# Altium project bg_per.PrjPcb
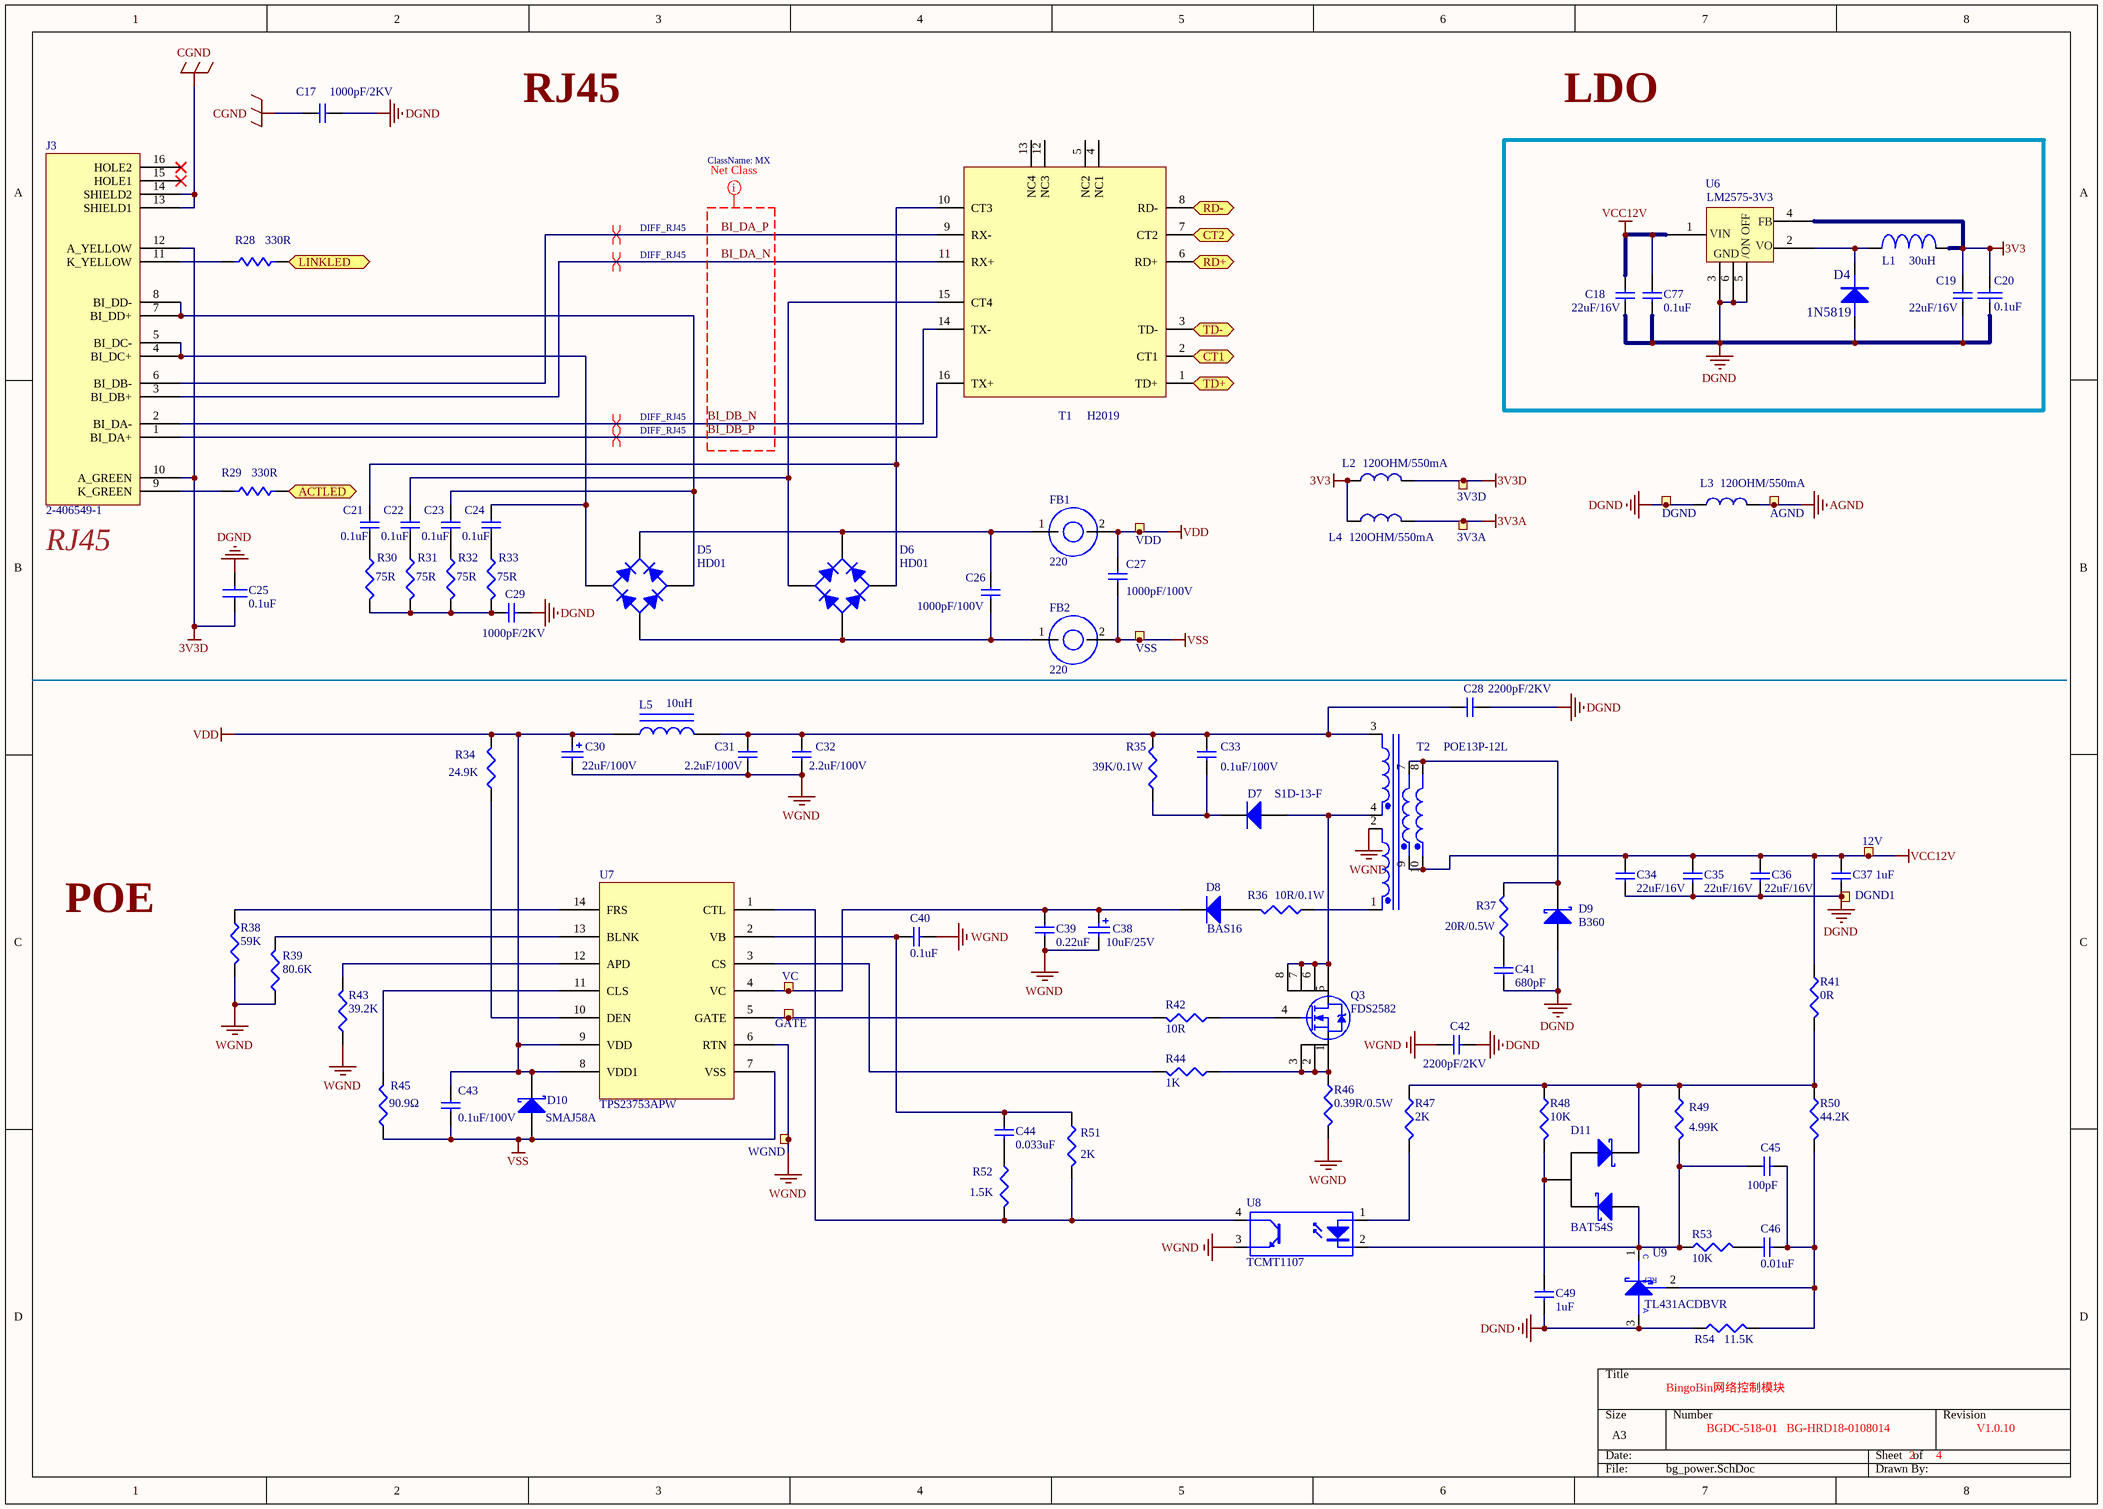
[diagram p0: bg_power.SchDoc]
4 sheets, 165 parts. Net scope: flat (ports and power ports of the same name join across sheets).
Board file: bg_PCB.PcbDoc
Sheets:
  bg_power.SchDoc
  bg_sensor.SchDoc
  bg_MCU.SchDoc
  view.SchDoc

## Sheet bg_power.SchDoc
size A3

### Parts
3V3A  ?.0mm,SMD  [TP_SMD_1_5mm]  (value not drawn)  (no BOM)
3V3D  ?.0mm,SMD  [TP_SMD_1_5mm]  (value not drawn)  (no BOM)
12V  ?.0mm,SMD  [TP_SMD_1_5mm]  (value not drawn)  (no BOM)
AGND  ?.0mm,SMD  [TP_SMD_1_5mm]  (value not drawn)  (no BOM)
C17  1000pF/2KV  [1808]
C18  22uF/16V  [C1210]
C19  22uF/16V  [C1210]
C20  0.1uF  [C0603]
C21  0.1uF  [C0603]
C22  0.1uF  [C0603]
C23  0.1uF  [C0603]
C24  0.1uF  [C0603]
C25  0.1uF  [C0603]
C26  1000pF/100V  [0805]
C27  1000pF/100V  [0805]
C28  2200pF/2KV  [1812]
C29  1000pF/2KV  [1808]
C30  22uF/100V  [C8*10.2mm]
C31  2.2uF/100V  [C1210]
C32  2.2uF/100V  [C1210]
C33  0.1uF/100V  [0805]
C34  22uF/16V  [C1210]
C35  22uF/16V  [C1210]
C36  22uF/16V  [C1210]
C37  1uF  [C0603]
C38  10uF/25V  [C4*5.8]
C39  0.22uF  [0805]
C40  0.1uF  [C0603]
C41  680pF  [0805]
C42  2200pF/2KV  [1812]
C43  0.1uF/100V  [0805]
C44  0.033uF  [C0603]
C45  100pF  [C0603]
C46  0.01uF  [C0603]
C49  1uF  [C0603]
C77  0.1uF  [C0603]
D4  1N5819  [SOD123]
D5  HD01  [HD01]
D6  HD01  [HD01]
D7  S1D-13-F  [SMA]
D8  BAS16  [SOT-23]
D9  B360  [SMC]
D10  SMAJ58A  [SMB]
D11  BAT54S  [SOT-23]
DGND  ?.0mm,SMD  [TP_SMD_1_5mm]  (value not drawn)  (no BOM)
DGND1  ?.0mm,SMD  [TP_SMD_1_5mm]  (value not drawn)  (no BOM)
FB1  220  [0805]
FB2  220  [0805]
GATE  ?.0mm,SMD  [TP_SMD_1mm]  (value not drawn)  (no BOM)
J3  2-406549-1  [RJ45LED]
L1  30uH  [L-7.5S]
L2  120OHM/550mA  [L0603]
L3  120OHM/550mA  [L0603]
L4  120OHM/550mA  [L0603]
L5  10uH  [L4*4mm]
Q3  FDS2582  [SO8]
R28  330R  [R0603]
R29  330R  [R0603]
R30  75R  [R0603]
R31  75R  [R0603]
R32  75R  [R0603]
R33  75R  [R0603]
R34  24.9K  [R0603]
R35  39K/0.1W  [0805]
R36  10R/0.1W  [0805]
R37  20R/0.5W  [2010]
R38  59K  [R0603]
R39  80.6K  [R0603]
R41  0R  [R0603]
R42  10R  [R0603]
R43  39.2K  [R0603]
R44  1K  [R0603]
R45  90.9Ω  [R0603]
R46  0.39R/0.5W  [1206]
R47  2K  [R0603]
R48  10K  [R0603]
R49  4.99K  [R0603]
R50  44.2K  [R0603]
R51  2K  [R0603]
R52  1.5K  [R0603]
R53  10K  [R0603]
R54  11.5K  [R0603]
T1  H2019  [H1102NL]
T2  POE13P-12L  [POE13P-12L]
U6  LM2575-3V3  [TO-263-5]
U7  TPS23753APW  [TPS23753a]
U8  TCMT1107  [SSOP4]
U9  TL431ACDBVR  [SOT-23]
VC  ?.0mm,SMD  [TP_SMD_1mm]  (value not drawn)  (no BOM)
VDD  ?.0mm,SMD  [TP_SMD_1_5mm]  (value not drawn)  (no BOM)
VSS  ?.0mm,SMD  [TP_SMD_1_5mm]  (value not drawn)  (no BOM)
WGND  ?.0mm,SMD  [TP_SMD_1mm]  (value not drawn)  (no BOM)

### Ports
ACTLED (bidir), CT1 (bidir), CT2 (bidir), LINKLED (bidir), RD+ (bidir), RD- (bidir), TD+ (bidir), TD- (bidir)

### Nets
3V3: C19.1 C20.1 L1.2 L2.1 L4.1 U6.4(FEEDBACK)
3V3A: 3V3A.1 L4.2
3V3D: 3V3D.1 C25.1 J3.10(A_GREEN) J3.12(A_YELLOW) L2.2
AGND: AGND.1 L3.2
CGND: C17.2 J3.13(SHIELD1) J3.14(SHIELD2)
DGND: C17.1 C18.2 C19.2 C20.2 C25.2 C28.2 C29.1 C34.1 C35.1 C36.1 C37.1 C41.1 C42.2 C49.1 C77.2 D4.1(A) D9.1(A) DGND.1 DGND1.1 L3.1 R54.1 U6.3(GND) U6.5(~{ON}/OFF) U6.6 U9.3(ANODE)
VCC12V: 12V.1 C18.1 C34.2 C35.2 C36.2 C37.2 C77.1 R41.1 T2.9(Pri+) T2.10(Pri+) U6.1(VIN)
VDD: C27.2 C30.1 C43.2 D10.2(K) FB1.2 L5.1 R34.2 U7.8(VDD1) U7.9(VDD) VDD.1
VSS: C27.1 C43.1 D10.1(A) FB2.2 R45.1 U7.7(VSS) VSS.1
WGND: C30.2 C31.1 C32.1 C38.2 C39.1 C40.1 C42.1 R38.2 R39.1 R43.1 R46.2 T2.2(Sec1-) U7.6(RTN) U8.3(E) WGND.1
BI_DA_N: J3.3(BI_DB+) T1.11(RX+)
BI_DA_P: J3.6(BI_DB-) T1.9(RX-)
BI_DB_N: J3.2(BI_DA-) T1.14(TX-)
BI_DB_P: J3.1(BI_DA+) T1.16(TX+)
RX_N: T1.8(RD-) ; port RD-
RX_P: T1.6(RD+) ; port RD+
TX_N: T1.3(TD-) ; port TD-
TX_P: T1.1(TD+) ; port TD+
NetC21_1: C21.1 R30.1
NetC21_2: C21.2 D6.2(C) T1.10(CT3)
NetC22_1: C22.1 R31.1
NetC22_2: C22.2 D6.4(C) T1.15(CT4)
NetC23_1: C23.1 R32.1
NetC23_2: C23.2 D5.2(C) J3.7(BI_DD+) J3.8(BI_DD-)
NetC24_1: C24.1 R33.1
NetC24_2: C24.2 D5.4(C) J3.4(BI_DC+) J3.5(BI_DC-)
NetC26_1: C26.1 D5.3(A) D6.3(A) FB2.1
NetC26_2: C26.2 D5.1(K) D6.1(K) FB1.1
NetC28_1: C28.1 C31.2 C32.2 C33.2 L5.2 R35.2 T2.3(Sec2-)
NetC29_2: C29.2 R30.2 R31.2 R32.2 R33.2
NetC33_1: C33.1 D7.2(K) R35.1
NetC38_1: C38.1 C39.2 D8.3(K) U7.4(VC) VC.1
NetC40_2: C40.2 C44.2 R51.1 U7.2(VB)
NetC41_2: C41.2 R37.1
NetC44_1: C44.1 R52.1
NetC45_1: C45.1 C46.1 R50.2 R54.2 U9.2(REF)
NetC45_2: C45.2 D11.1 R49.2 R53.1 U8.2(K) U9.1(cathode)
NetC46_2: C46.2 R53.2
NetC48_1: T1.2(CT1) ; port CT1
NetC49_2: C49.2 D11.3 R48.2
NetC56_1: T1.7(CT2) ; port CT2
NetD4_2: D4.2(K) L1.1 U6.2(OUTPU8T)
NetD7_1: D7.1(A) Q3.5(D) Q3.6 Q3.7 Q3.8 T2.4(Sec2+)
NetD8_1: D8.1(A) R36.2
NetD9_2: D9.2(K) R37.2 T2.7(Pri-) T2.8(Pri-)
NetD11_2: D11.2 R41.2 R47.1 R48.1 R49.1 R50.1
NetGATE_1: GATE.1 R42.2 U7.5(GATE)
NetJ3_9: J3.9(K_GREEN) R29.1
NetJ3_11: J3.11(K_YELLOW) R28.1
NetQ3_1: Q3.1(S) Q3.2 Q3.3 R44.1 R46.1
NetQ3_4: Q3.4(G) R42.1
NetR28_2: R28.2 ; port LINKLED
NetR29_2: R29.2 ; port ACTLED
NetR34_1: R34.1 U7.10(DEN)
NetR36_1: R36.1 T2.1(Sec1+)
NetR38_1: R38.1 U7.14(FRS)
NetR39_2: R39.2 U7.13(BLNK)
NetR43_2: R43.2 U7.12(APD)
NetR44_2: R44.2 U7.3(CS)
NetR45_2: R45.2 U7.11(CLS)
NetR47_2: R47.2 U8.1(A)
NetR51_2: R51.2 R52.2 U7.1(CTL) U8.4(C)

Not connected (* = marked no-connect by the designer): J3 15(HOLE1)* 16(HOLE2)*; T1 4(NC1) 5(NC2) 12(NC3) 13(NC4)

### Layout directives
differential pair; net class DIFF_RJ45: BI_DA_N, BI_DA_P, BI_DB_N, BI_DB_P
net class MX: BI_DA_N, BI_DA_P, BI_DB_N, BI_DB_P

### Notes on the sheet
- RJ45
- LDO
- (near J3) RJ45
- POE
- BingoBin网络控制模块
- BGDC-518-01   BG-HRD18-0108014
- 2
- 4
- V1.0.10
- (in symbol LM2575) FB; VO; /ON OFF
- (in symbol TL431AQDBZR) C; A

### Library data of the parts
3V3A 3V3D 12V AGND DGND DGND1 GATE VC VDD VSS WGND = TESTPAD: 1.0mm circular SMD testpad; Part Number: TP_SMD_?.0MM; Manufacturer: Nordic Semiconductor; Artikkelnr Noca: N.A.; Manufacturer Part Number: *; Datasheet: *; LatestRevisionDate: 2013-06-11; Pin Count: 1; Publisher: Nordic Semiconductor; Published: 2013-06-11; Value: ?.0mm,SMD; Note: *; Supplier: *; Supplier part number: *; 2nd source Supplier: *; 2nd source part number: *; Footprint Doc: TP_SMD_?.0mm; Artikkelnr Simpro: N.A.
C17 C29 = CAP_0603: Capacitor, Ceramic Chip,1000pF, 2KV, 10%,1808; Part Number: C0603-4µ7; Note: 6.3V; Artikkelnr Noca: 20069060; Artikkelnr Simpro: N.A.; Manufacturer: *; Manufacturer Part Number: *; Datasheet: *; LatestRevisionDate: 2009-11-23; Pin Count: 2; Publisher: Nordic Semiconductor; Published: 2009-05-08; Value: 1000pF/2KV; Supplier: *; Supplier part number: *; 2nd source Supplier: *; 2nd source part number: *; Footprint Doc: 0603
C18 C19 C34-C36 = CAP_0603: Capacitor, Ceramic, 22uF,16V, 10%,1210,X5R; Part Number: C0603-4µ7; Note: 6.3V; Artikkelnr Noca: 20069060; Artikkelnr Simpro: N.A.; Manufacturer: *; Manufacturer Part Number: *; Datasheet: *; LatestRevisionDate: 2009-11-23; Pin Count: 2; Publisher: Nordic Semiconductor; Published: 2009-05-08; Value: 22uF/16V; Supplier: *; Supplier part number: *; 2nd source Supplier: *; 2nd source part number: *; Footprint Doc: 0603
C20 = CAP: Capacitor, Ceramic, 0.1uF, 16V, 10%, 0603, X7R
C21-C24 = CAP_0603: Capacitor, Ceramic, 0.1uF, 100V, 10%, 0603, X7R; Part Number: C0603-4µ7; Note: 6.3V; Artikkelnr Noca: 20069060; Artikkelnr Simpro: N.A.; Manufacturer: *; Manufacturer Part Number: *; Datasheet: *; LatestRevisionDate: 2009-11-23; Pin Count: 2; Publisher: Nordic Semiconductor; Published: 2009-05-08; Value: 0.1uF; Supplier: *; Supplier part number: *; 2nd source Supplier: *; 2nd source part number: *; Footprint Doc: 0603
C25 = C1005X5R1H104K: Capacitor, Ceramic, 0.1uF, 16V, 10%, 0603, X7R; Manufacturer: TDK Corporation; Capacitance: 0.1礔; .Checked PCB: used; Voltage - Rated: 50V; Tolerance: ?0%; Temperature Coefficient: X5R; Category: Capacitors; Supplier Part Number: 445-5942-1-ND; Manufacturer Part Number: C1005X5R1H104K; Operating Temperature: -55癈 ~ 85癈; Package / Case: 0402 (1005 Metric); Price 1k [$]: 0.02340; Value: 0.1uF; .Checked SCH: used; Supplier: Digikey; Supplier 1: Digi-Key; Supplier Part Number 1: 445-5942-1-ND; RoHS: RoHS Compliant; Stock 1: 106926; Pricing 1: 1=0.27, 10=0.18, 100=0.072, 250=0.05176, 500=0.0369, 1000=0.027 (USD); Mounting Type: Surface Mount, MLCC; Applications: General Purpose; Ratings: -; Size / Dimension: 0.039" L x 0.020" W (1.00mm x 0.50mm); Height - Seated (Max): -; Thickness (Max): 0.022" (0.55mm); Lead Spacing: -; Features: -; Packaging: Cut Tape (CT); Lead Style: -; ComponentLink1URL: http://www.tdk.co.jp/tefe02/e412_c.pdf; ComponentLink1Description: http://www.tdk.co.jp/tefe02/e412_c.pdf
C26 C27 = CAP_0603: Capacitor, Ceramic, 1000pF,100V, 10%,0805,X7R; Part Number: C0603-4µ7; Note: 6.3V; Artikkelnr Noca: 20069060; Artikkelnr Simpro: N.A.; Manufacturer: *; Manufacturer Part Number: *; Datasheet: *; LatestRevisionDate: 2009-11-23; Pin Count: 2; Publisher: Nordic Semiconductor; Published: 2009-05-08; Value: 1000pF/100V; Supplier: *; Supplier part number: *; 2nd source Supplier: *; 2nd source part number: *; Footprint Doc: 0603
C28 C42 = CAP_0603: Capacitor, Ceramic, 2200pF,2KV, 20%,1812,X7R; Part Number: C0603-4µ7; Note: 6.3V; Artikkelnr Noca: 20069060; Artikkelnr Simpro: N.A.; Manufacturer: *; Manufacturer Part Number: *; Datasheet: *; LatestRevisionDate: 2009-11-23; Pin Count: 2; Publisher: Nordic Semiconductor; Published: 2009-05-08; Value: 2200pF/2KV; Supplier: *; Supplier part number: *; 2nd source Supplier: *; 2nd source part number: *; Footprint Doc: 0603
C30 = Cap Pol2: Capacitor, Aluminum Electrolytic, 22uF,100V, 20%; Published: 8-Jun-2000; LatestRevisionDate: 17-Jul-2002; LatestRevisionNote: Re-released for DXP Platform.; PackageReference: POLAR0.8; Publisher: Altium Limited; PackageDescription: Polarized Capacitor; 2 Leads; Value: 22uF/100V
C31 C32 = CAP_0603: Capacitor, Ceramic, 2.2uF,100V, 10%,1210,X7R; Part Number: C0603-4µ7; Note: 6.3V; Artikkelnr Noca: 20069060; Artikkelnr Simpro: N.A.; Manufacturer: *; Manufacturer Part Number: *; Datasheet: *; LatestRevisionDate: 2009-11-23; Pin Count: 2; Publisher: Nordic Semiconductor; Published: 2009-05-08; Value: 2.2uF/100V; Supplier: *; Supplier part number: *; 2nd source Supplier: *; 2nd source part number: *; Footprint Doc: 0603
C33 C43 = CAP_0603: Capacitor, Ceramic, 0.1uF,100V, 10%,0805,X7R; Part Number: C0603-4µ7; Note: 6.3V; Artikkelnr Noca: 20069060; Artikkelnr Simpro: N.A.; Manufacturer: *; Manufacturer Part Number: *; Datasheet: *; LatestRevisionDate: 2009-11-23; Pin Count: 2; Publisher: Nordic Semiconductor; Published: 2009-05-08; Value: 0.1uF/100V; Supplier: *; Supplier part number: *; 2nd source Supplier: *; 2nd source part number: *; Footprint Doc: 0603
C37 C49 = CAP_0603: Capacitor, Ceramic, 1uF, 25V, 10%, 0603, X7R; Part Number: C0603-4µ7; Note: 6.3V; Artikkelnr Noca: 20069060; Artikkelnr Simpro: N.A.; Manufacturer: *; Manufacturer Part Number: *; Datasheet: *; LatestRevisionDate: 2009-11-23; Pin Count: 2; Publisher: Nordic Semiconductor; Published: 2009-05-08; Value: 1uF; Supplier: *; Supplier part number: *; 2nd source Supplier: *; 2nd source part number: *; Footprint Doc: 0603
C38 = Cap Pol2: Capacitor, Aluminum,10uF, 25V, 20%; Published: 8-Jun-2000; LatestRevisionDate: 17-Jul-2002; LatestRevisionNote: Re-released for DXP Platform.; PackageReference: POLAR0.8; Publisher: Altium Limited; PackageDescription: Polarized Capacitor; 2 Leads; Value: 10uF/25V
C39 = CAP_0603: Capacitor, Ceramic, 0.22uF,25V, 10%,0805,X7R; Part Number: C0603-4µ7; Note: 6.3V; Artikkelnr Noca: 20069060; Artikkelnr Simpro: N.A.; Manufacturer: *; Manufacturer Part Number: *; Datasheet: *; LatestRevisionDate: 2009-11-23; Pin Count: 2; Publisher: Nordic Semiconductor; Published: 2009-05-08; Value: 0.22uF; Supplier: *; Supplier part number: *; 2nd source Supplier: *; 2nd source part number: *; Footprint Doc: 0603
C40 = CAP_0603: Capacitor, Ceramic, 0.1uF, 16V, 10%, 0603, X7R; Part Number: C0603-4µ7; Note: 6.3V; Artikkelnr Noca: 20069060; Artikkelnr Simpro: N.A.; Manufacturer: *; Manufacturer Part Number: *; Datasheet: *; LatestRevisionDate: 2009-11-23; Pin Count: 2; Publisher: Nordic Semiconductor; Published: 2009-05-08; Value: 0.1uF; Supplier: *; Supplier part number: *; 2nd source Supplier: *; 2nd source part number: *; Footprint Doc: 0603
C41 = CAP_0603: Capacitor, Ceramic, 680pF,50V,5%,0805, NPO; Part Number: C0603-4µ7; Note: 6.3V; Artikkelnr Noca: 20069060; Artikkelnr Simpro: N.A.; Manufacturer: *; Manufacturer Part Number: *; Datasheet: *; LatestRevisionDate: 2009-11-23; Pin Count: 2; Publisher: Nordic Semiconductor; Published: 2009-05-08; Value: 680pF; Supplier: *; Supplier part number: *; 2nd source Supplier: *; 2nd source part number: *; Footprint Doc: 0603
C44 = CAP_0603: Capacitor, Ceramic, 0.033uF, 50V, 10%, 0603, X7R; Part Number: C0603-4µ7; Note: 6.3V; Artikkelnr Noca: 20069060; Artikkelnr Simpro: N.A.; Manufacturer: *; Manufacturer Part Number: *; Datasheet: *; LatestRevisionDate: 2009-11-23; Pin Count: 2; Publisher: Nordic Semiconductor; Published: 2009-05-08; Value: 0.033uF; Supplier: *; Supplier part number: *; 2nd source Supplier: *; 2nd source part number: *; Footprint Doc: 0603
C45 = CAP_0603: Capacitor, Ceramic, 100pF, 50V, 5%, 0603, X7R; Part Number: C0603-4µ7; Note: 6.3V; Artikkelnr Noca: 20069060; Artikkelnr Simpro: N.A.; Manufacturer: *; Manufacturer Part Number: *; Datasheet: *; LatestRevisionDate: 2009-11-23; Pin Count: 2; Publisher: Nordic Semiconductor; Published: 2009-05-08; Value: 100pF; Supplier: *; Supplier part number: *; 2nd source Supplier: *; 2nd source part number: *; Footprint Doc: 0603
C46 = CAP_0603: Capacitor, Ceramic, 0.01uF, 50V, 10%, 0603, X7R; Part Number: C0603-4µ7; Note: 6.3V; Artikkelnr Noca: 20069060; Artikkelnr Simpro: N.A.; Manufacturer: *; Manufacturer Part Number: *; Datasheet: *; LatestRevisionDate: 2009-11-23; Pin Count: 2; Publisher: Nordic Semiconductor; Published: 2009-05-08; Value: 0.01uF; Supplier: *; Supplier part number: *; 2nd source Supplier: *; 2nd source part number: *; Footprint Doc: 0603
C77 = CAP_0603: Capacitor, X5R, ±10%; Part Number: C0603-4µ7; Note: 6.3V; Artikkelnr Noca: 20069060; Artikkelnr Simpro: N.A.; Manufacturer: *; Manufacturer Part Number: *; Datasheet: *; LatestRevisionDate: 2009-11-23; Pin Count: 2; Publisher: Nordic Semiconductor; Published: 2009-05-08; Value: 0.1uF; Supplier: *; Supplier part number: *; 2nd source Supplier: *; 2nd source part number: *; Footprint Doc: 0603
D4 = DIODE: Diode Schottky, 40V,1A
D5 D6 = Bridge1: Bridge Rectifier, 100V, 0.8A, Glass Passivated, SMD; Published: 8-Jun-2000; LatestRevisionDate: 29-May-2009; LatestRevisionNote: Sch pins A & K swapped.; DatasheetVersion: E2732B; PackageReference: D-38; Publisher: Altium Limited; PackageDescription: Bridge Rectifier; 4 Terminals; Body 9.4 x 9.4 mm (typ); Pitch 5.08 mm
D7 = Diode: Diode, Rectifier, 1A, 200V; Published: 8-Jun-2000; LatestRevisionDate: 17-Jul-2002; LatestRevisionNote: Re-released for DXP Platform.; PackageVersion: Sep-1996; PackageReference: SMC; Publisher: Altium Limited; PackageDescription: DO-214-AB/SMC; 2 C-Bend Leads; Body 7.9 x 5.9 mm, inc. leads (LxW); Code_JEDEC: DO-214-AB
D8 = BAS16: Diode, Switching, 200mA, 75V, 225mW; Published: 8-Jun-2000; LatestRevisionDate: 17-Jul-2002; LatestRevisionNote: Re-released for DXP Platform.; PackageVersion: Sep-1996; PackageReference: SMC; Publisher: Altium Limited; PackageDescription: DO-214-AB/SMC; 2 C-Bend Leads; Body 7.9 x 5.9 mm, inc. leads (LxW); Code_JEDEC: DO-214-AB
D9 = D Schottky: Diode Schottky, 60V, 3A, SMC; Published: 8-Jun-2000; LatestRevisionDate: 17-Jul-2002; LatestRevisionNote: Re-released for DXP Platform.; PackageReference: SMB; Publisher: Altium Limited; PackageDescription: DO-214-AA/SMB; 2 C-Bend Leads; Body 5.3 x 3.6 mm, inc. leads (LxW); Code_JEDEC: DO-214-AA
D10 = D Schottky: Diode,Transient Voltage Suppressor,400W,58V; Published: 8-Jun-2000; LatestRevisionDate: 17-Jul-2002; LatestRevisionNote: Re-released for DXP Platform.; PackageReference: SMB; Publisher: Altium Limited; PackageDescription: DO-214-AA/SMB; 2 C-Bend Leads; Body 5.3 x 3.6 mm, inc. leads (LxW); Code_JEDEC: DO-214-AA
D11 = D Schottky: Diode, Dual Schottky, 200mA, 30V; Published: 8-Jun-2000; LatestRevisionDate: 17-Jul-2002; LatestRevisionNote: Re-released for DXP Platform.; PackageReference: SMB; Publisher: Altium Limited; PackageDescription: DO-214-AA/SMB; 2 C-Bend Leads; Body 5.3 x 3.6 mm, inc. leads (LxW); Code_JEDEC: DO-214-AA
FB1 FB2 = FB: Bead, Ferrite, SMT, 220 Ohms, 3A
J3 = 2-406549-1: RJ45连接器/RJ45网口连接器,8p8c,90°,黄-绿LED灯,镀金,带屏蔽; Manufacturer: Tyco; .Checked PCB: used; Connector Type: Jack; Number of Positions: 8p8c (RJ45, Ethernet); Number of Ports: 1; Shielding: Shielded, EMI Finger; Ratings: Cat5; LED Color: Yellow - Green; Tab Direction: Up; .Checked SCH: used; Category: Connectors, Interconnects; Manufacturer Part Number: 2-406549-1; Price 1k [$]: 1.73278; Supplier: Digikey; Supplier Part Number: A97715-ND; Value: 2-406549-1; Supplier 1: Digi-Key; Supplier Part Number 1: A97715-ND; RoHS: RoHS Compliant; Stock 1: 9021; Pricing 1: 1=3.42 (USD); Number of Positions/Contacts: 8p8c (RJ45, Ethernet); Number of Rows: 1; Mounting Type: Through Hole; Orientation: 90?Angle (Right); Termination: Solder; Features: Board Lock; Packaging: Tray; Housing Material: Thermoplastic; Contact Material: Phosphor Bronze; Contact Finish: Gold; Operating Temperature: -40癈 ~ 85癈; ComponentLink1URL: http://documents.tycoelectronics.com/commerce/DocumentDelivery/DDEController?Action=srchrtrv&DocNm=406549&DocType=CD&DocLang=EN; ComponentLink1Description: http://documents.tycoelectronics.com/commerce/DocumentDelivery/DDEController?Action=srchrtrv&DocNm=406549&DocType=CD&DocLang=EN
L1 = BEAD: 330uH功率电感; Text Field1: Tie pins 14 and 15 to positive supply or leave floating. Do not tie to VSSA
L2-L4 = L0603: Bead, Ferrite, SMT, 120 Ohms, 3A; Type: 120OHM/550mA
L5 = Inductor Iron: Inductor, SMT, 750mA, 350 milliohm,10uH; Published: 24-Mar-1999; LatestRevisionDate: 17-Jul-2002; LatestRevisionNote: Re-released for DXP Platform.; PackageReference: AXIAL-0.9; Publisher: Altium Limited; PackageDescription: Axial Device, Thru-Hole; 2 Leads; 0.9 in Pin Spacing; Value: 10uH
Q3 = NMOS-2: MOSFET, N-ch, 150-V, 4.1A, 66 milliOhms; Note: Pin 2 is electrically connected to pin 4.; Published: 8-Jun-2000; LatestRevisionDate: 17-Jul-2002; LatestRevisionNote: Re-released for DXP Platform.; DatasheetVersion: PD-9.814; PackageVersion: Feb-1997; PackageReference: TO-220AB; Publisher: Altium Limited; PackageDescription: TO, Thru-Hole, Vertical, Heatsink Mounted; 3 In-Line Leads; Pitch 2.54 mm; ComponentLink1Description: Manufacturer Link; ComponentLink1URL: http://www.irf.com/
R28 R29 = R0603: RES, THICK FILM, 330 OHM, 5%, 1/10W, 0603; Value: 330R
R30-R33 = Res3: RES, THICK FILM, 75 OHM, 1%, 1/10W, 0603; Published: 8-Jun-2000; LatestRevisionDate: 29-May-2009; LatestRevisionNote: IPC-7351 Footprint Added.; PackageReference: J1-0603; Publisher: Altium Limited; PackageDescription: Chip Resistor; Value: 75R
R34 = Res3: RES, THICK FILM, 24.9K, 1%, 1/10W, 0603; Published: 8-Jun-2000; LatestRevisionDate: 29-May-2009; LatestRevisionNote: IPC-7351 Footprint Added.; PackageReference: J1-0603; Publisher: Altium Limited; PackageDescription: Chip Resistor; Value: 24.9K
R35 = Res3: RES, THICK FILM, 39K, 1%, 1/8W, 0805; Published: 8-Jun-2000; LatestRevisionDate: 29-May-2009; LatestRevisionNote: IPC-7351 Footprint Added.; PackageReference: J1-0603; Publisher: Altium Limited; PackageDescription: Chip Resistor; Value: 39K/0.1W
R36 = Res3: RES, THICK FILM, 10 OHM, 1%, 1/8W, 0805; Published: 8-Jun-2000; LatestRevisionDate: 29-May-2009; LatestRevisionNote: IPC-7351 Footprint Added.; PackageReference: J1-0603; Publisher: Altium Limited; PackageDescription: Chip Resistor; Value: 10R/0.1W
R37 = Res3: RES, THICK FILM, 20 OHM, 5%, 1/2W, 2010; Published: 8-Jun-2000; LatestRevisionDate: 29-May-2009; LatestRevisionNote: IPC-7351 Footprint Added.; PackageReference: J1-0603; Publisher: Altium Limited; PackageDescription: Chip Resistor; Value: 20R/0.5W
R38 = Res3: RES, THICK FILM, 59K, 1%, 1/10W, 0603; Published: 8-Jun-2000; LatestRevisionDate: 29-May-2009; LatestRevisionNote: IPC-7351 Footprint Added.; PackageReference: J1-0603; Publisher: Altium Limited; PackageDescription: Chip Resistor; Value: 59K
R39 = Res3: RES, THICK FILM, 80.6K, 1%, 1/10W, 0603; Published: 8-Jun-2000; LatestRevisionDate: 29-May-2009; LatestRevisionNote: IPC-7351 Footprint Added.; PackageReference: J1-0603; Publisher: Altium Limited; PackageDescription: Chip Resistor; Value: 80.6K
R41 = Res3: RES, THICK FILM, 0 OHM, 1%, 1/10W, 0603; Published: 8-Jun-2000; LatestRevisionDate: 29-May-2009; LatestRevisionNote: IPC-7351 Footprint Added.; PackageReference: J1-0603; Publisher: Altium Limited; PackageDescription: Chip Resistor; Value: 0R
R42 = Res3: RES, THICK FILM, 10 OHM, 5%, 1/10W, 0603; Published: 8-Jun-2000; LatestRevisionDate: 29-May-2009; LatestRevisionNote: IPC-7351 Footprint Added.; PackageReference: J1-0603; Publisher: Altium Limited; PackageDescription: Chip Resistor; Value: 10R
R43 = Res3: RES, THICK FILM, 39.2K, 1%, 1/10W, 0603; Published: 8-Jun-2000; LatestRevisionDate: 29-May-2009; LatestRevisionNote: IPC-7351 Footprint Added.; PackageReference: J1-0603; Publisher: Altium Limited; PackageDescription: Chip Resistor; Value: 39.2K
R44 = Res3: RES, THICK FILM, 1K, 5%, 1/10W, 0603; Published: 8-Jun-2000; LatestRevisionDate: 29-May-2009; LatestRevisionNote: IPC-7351 Footprint Added.; PackageReference: J1-0603; Publisher: Altium Limited; PackageDescription: Chip Resistor; Value: 1K
R45 = Res3: RES, THICK FILM, 90.9 OHM, 1%, 1/10W, 0603; Published: 8-Jun-2000; LatestRevisionDate: 29-May-2009; LatestRevisionNote: IPC-7351 Footprint Added.; PackageReference: J1-0603; Publisher: Altium Limited; PackageDescription: Chip Resistor; Value: 90.9Ω
R46 = Res3: RES, THICK FILM, 0.39 OHM, 1%, 3/4W, 2010; Published: 8-Jun-2000; LatestRevisionDate: 29-May-2009; LatestRevisionNote: IPC-7351 Footprint Added.; PackageReference: J1-0603; Publisher: Altium Limited; PackageDescription: Chip Resistor; Value: 0.39R/0.5W
R47 R51 = Res3: RES, THICK FILM, 2K, 5%, 1/10W, 0603; Published: 8-Jun-2000; LatestRevisionDate: 29-May-2009; LatestRevisionNote: IPC-7351 Footprint Added.; PackageReference: J1-0603; Publisher: Altium Limited; PackageDescription: Chip Resistor; Value: 2K
R48 R53 = Res3: RES, THICK FILM, 10K, 5%, 1/10W, 0603; Published: 8-Jun-2000; LatestRevisionDate: 29-May-2009; LatestRevisionNote: IPC-7351 Footprint Added.; PackageReference: J1-0603; Publisher: Altium Limited; PackageDescription: Chip Resistor; Value: 10K
R49 = Res3: RES, THICK FILM, 4.99K, 1%, 1/10W, 0603; Published: 8-Jun-2000; LatestRevisionDate: 29-May-2009; LatestRevisionNote: IPC-7351 Footprint Added.; PackageReference: J1-0603; Publisher: Altium Limited; PackageDescription: Chip Resistor; Value: 4.99K
R50 = Res3: RES, THICK FILM, 44.2K, 1%, 1/10W, 0603; Published: 8-Jun-2000; LatestRevisionDate: 29-May-2009; LatestRevisionNote: IPC-7351 Footprint Added.; PackageReference: J1-0603; Publisher: Altium Limited; PackageDescription: Chip Resistor; Value: 44.2K
R52 = Res3: RES, THICK FILM, 1.5K, 5%, 1/10W, 0603; Published: 8-Jun-2000; LatestRevisionDate: 29-May-2009; LatestRevisionNote: IPC-7351 Footprint Added.; PackageReference: J1-0603; Publisher: Altium Limited; PackageDescription: Chip Resistor; Value: 1.5K
R54 = Res3: RES, THICK FILM, 11.5K, 1%, 1/10W, 0603; Published: 8-Jun-2000; LatestRevisionDate: 29-May-2009; LatestRevisionNote: IPC-7351 Footprint Added.; PackageReference: J1-0603; Publisher: Altium Limited; PackageDescription: Chip Resistor; Value: 11.5K
T1 = H1102NL: XFMR, 1000 Base-T, Ratio 1:1
T2 = Trans3: Transformer, Flyback For PoE, 12V, 1A; Sim Note: Enter the turns ratios, Core loss resistance, Magnetising Reactance, Leakage Reactances and Resistances referred to the primary side into the parameter fields.; Published: 25-Jan-2001; LatestRevisionDate: 17-Jul-2002; LatestRevisionNote: Re-released for DXP Platform.; PackageReference: TRF_6; Publisher: Altium Limited; PackageDescription: Transformer; 6 Leads
U6 = LM2575: SIMPLE SWITCHER® 1A Step-Down Voltage Regulator
U7 = TPS23753APW: IC, IEEE 802.3af Integrated Primary Side Controller
U8 = Optoisolator1: IC, Photocoupler, 3750VRMS, 80-160% CTR; Published: 24-Mar-1999; LatestRevisionDate: 04-Mar-2005; LatestRevisionNote: Sch pins 3 & 4 Swapped.; DatasheetVersion: Nov-2003; PackageReference: DIP-4; Publisher: Altium Limited
U9 = TL431AQDBZR: IC, Shunt Regulator, 2.5V Ref, 36V, 100mA, 1%; Manufacturer: Texas Instruments; Output Type: Adjustable; Voltage - Output (Min/Fixed): 2.495V; Current - Cathode: 700µA; .Checked PCB: MM; Supplier 1: Digi-Key; Manufacturer Part Number: TL431AQDBZR; RoHS: RoHS Compliant; Category: Integrated Circuits (ICs); Stock 1: 14090; Pricing 1: 1=0.48, 10=0.323, 100=0.151, 1000=0.131 (USD); Packaging: Cut Tape (CT); Reference Type: Shunt; Voltage - Output (Max): 36V; Current - Output: 100mA; Tolerance: ±1%; Temperature Coefficient: -; Noise - 0.1Hz to 10Hz: -; Noise - 10Hz to 10kHz: -; Voltage - Input: -; Current - Supply: -; Operating Temperature: -40°C ~ 125°C (TA); Mounting Type: Surface Mount; Package / Case: TO-236-3, SC-59, SOT-23-3; Supplier Device Package: SOT-23-3; ComponentLink1URL: http://www.ti.com/lit/ds/symlink/tl431a.pdf; ComponentLink1Description: http://www.ti.com/lit/ds/symlink/tl431a.pdf; Supplier Part Number 1: 296-18864-1-ND; .Checked SCH: MM; .Creator: MM

## Sheet bg_sensor.SchDoc
size A3
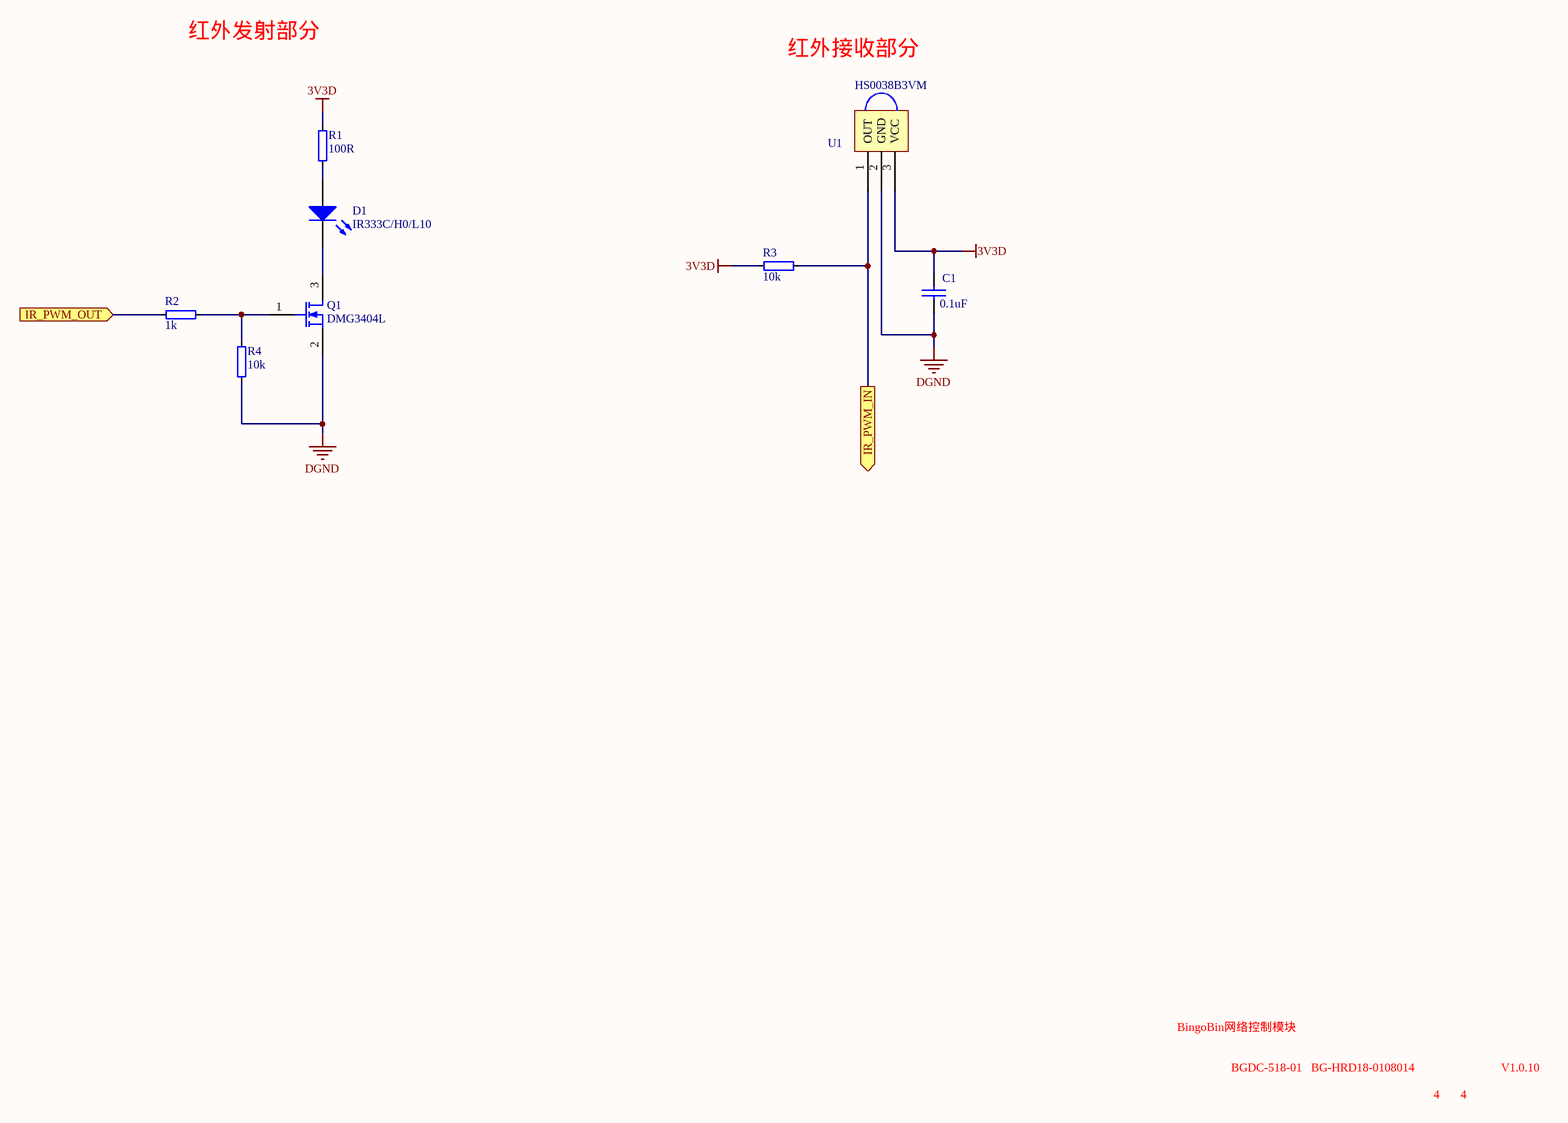
[diagram p1: bg_sensor.SchDoc]

### Parts
C1  0.1uF  [C0603]
D1  IR333C/H0/L10  [LED]
Q1  DMG3404L  [sot-23]
R1  100R  [R0603]
R2  1k  [R0603]
R3  10k  [R0603]
R4  10k  [R0603]
U1  HS0038B3VM  [DIP_3]

### Ports
IR_PWM_IN (out), IR_PWM_OUT (in)

### Nets
3V3D: C1.2 R1.2 R3.2 U1.3(VCC)
DGND: C1.1 Q1.2(S) R4.1 U1.2(GND)
NetD1_1: D1.1(A) R1.1
NetD1_2: D1.2(K) Q1.3(D)
NetQ1_1: Q1.1(G) R2.2 R4.2
NetR2_1: R2.1 ; port IR_PWM_OUT
NetR3_1: R3.1 U1.1(OUT) ; port IR_PWM_IN

### Notes on the sheet
- 红外发射部分
- 红外接收部分
- BingoBin网络控制模块
- BGDC-518-01   BG-HRD18-0108014
- 4
- V1.0.10

### Library data of the parts
C1 = C0603: Capacitor, Ceramic, 0.1uF, 16V, 10%, 0603, X7R; Manufacturer: muRata; Value: 0.1uF; Manufacturer Part Number: *
D1 = LED1: Typical RED GaAs LED; Manufacturer: EVERLIGHT; Value: IR333C/H0/L10; data_net: http://www.szlcsc.com/product/pdf/A_CE940DB3AD015B83.PDF; Manufacturer Part Number: IR333C/H0/L10
Q1 = MOSFET-N: N沟道,30V,5.6A,27mΩ(Typ,@Vgs=4.5V); Manufacturer: DIODES; Published: 8-Jun-2000; LatestRevisionDate: 17-Jul-2002; LatestRevisionNote: Re-released for DXP Platform.; PackageVersion: 1995/1996; PackageReference: E3; Publisher: Altium Limited; PackageDescription: TO, Flat Index; 3 In-Line, Axial Leads; Body Dia. 4.6mm; Lead Dia. 0.5 mm (max); Manufacturer Part Number: DMG3404L; Value: DMG3404L
R1-R4 = R0402-12k: RES, THICK FILM, 10K, 5%, 1/10W, 0603; Part Number: R0402-10k; Manufacturer: muRata; Note: Chip Res 1%; Artikkelnr Noca: 27049099; Manufacturer Part Number: *; Datasheet: *; Footprint: 0402; LatestRevisionDate: 2009-11-23; Pin Count: 2; Publisher: Nordic Semiconductor; Published: 2009-05-08; Supplier: Farnell; Supplier part number: 173-8865; 2nd source Supplier: *; 2nd source part number: *
  R1: Value: 100R
  R2: Value: 1k
  R3 R4: Value: 10k
U1 = 1838: Manufacturer: Vishay; Value: HS0038B3VM; Manufacturer Part Number: HS0038B3VM

## Sheet bg_MCU.SchDoc
size A2
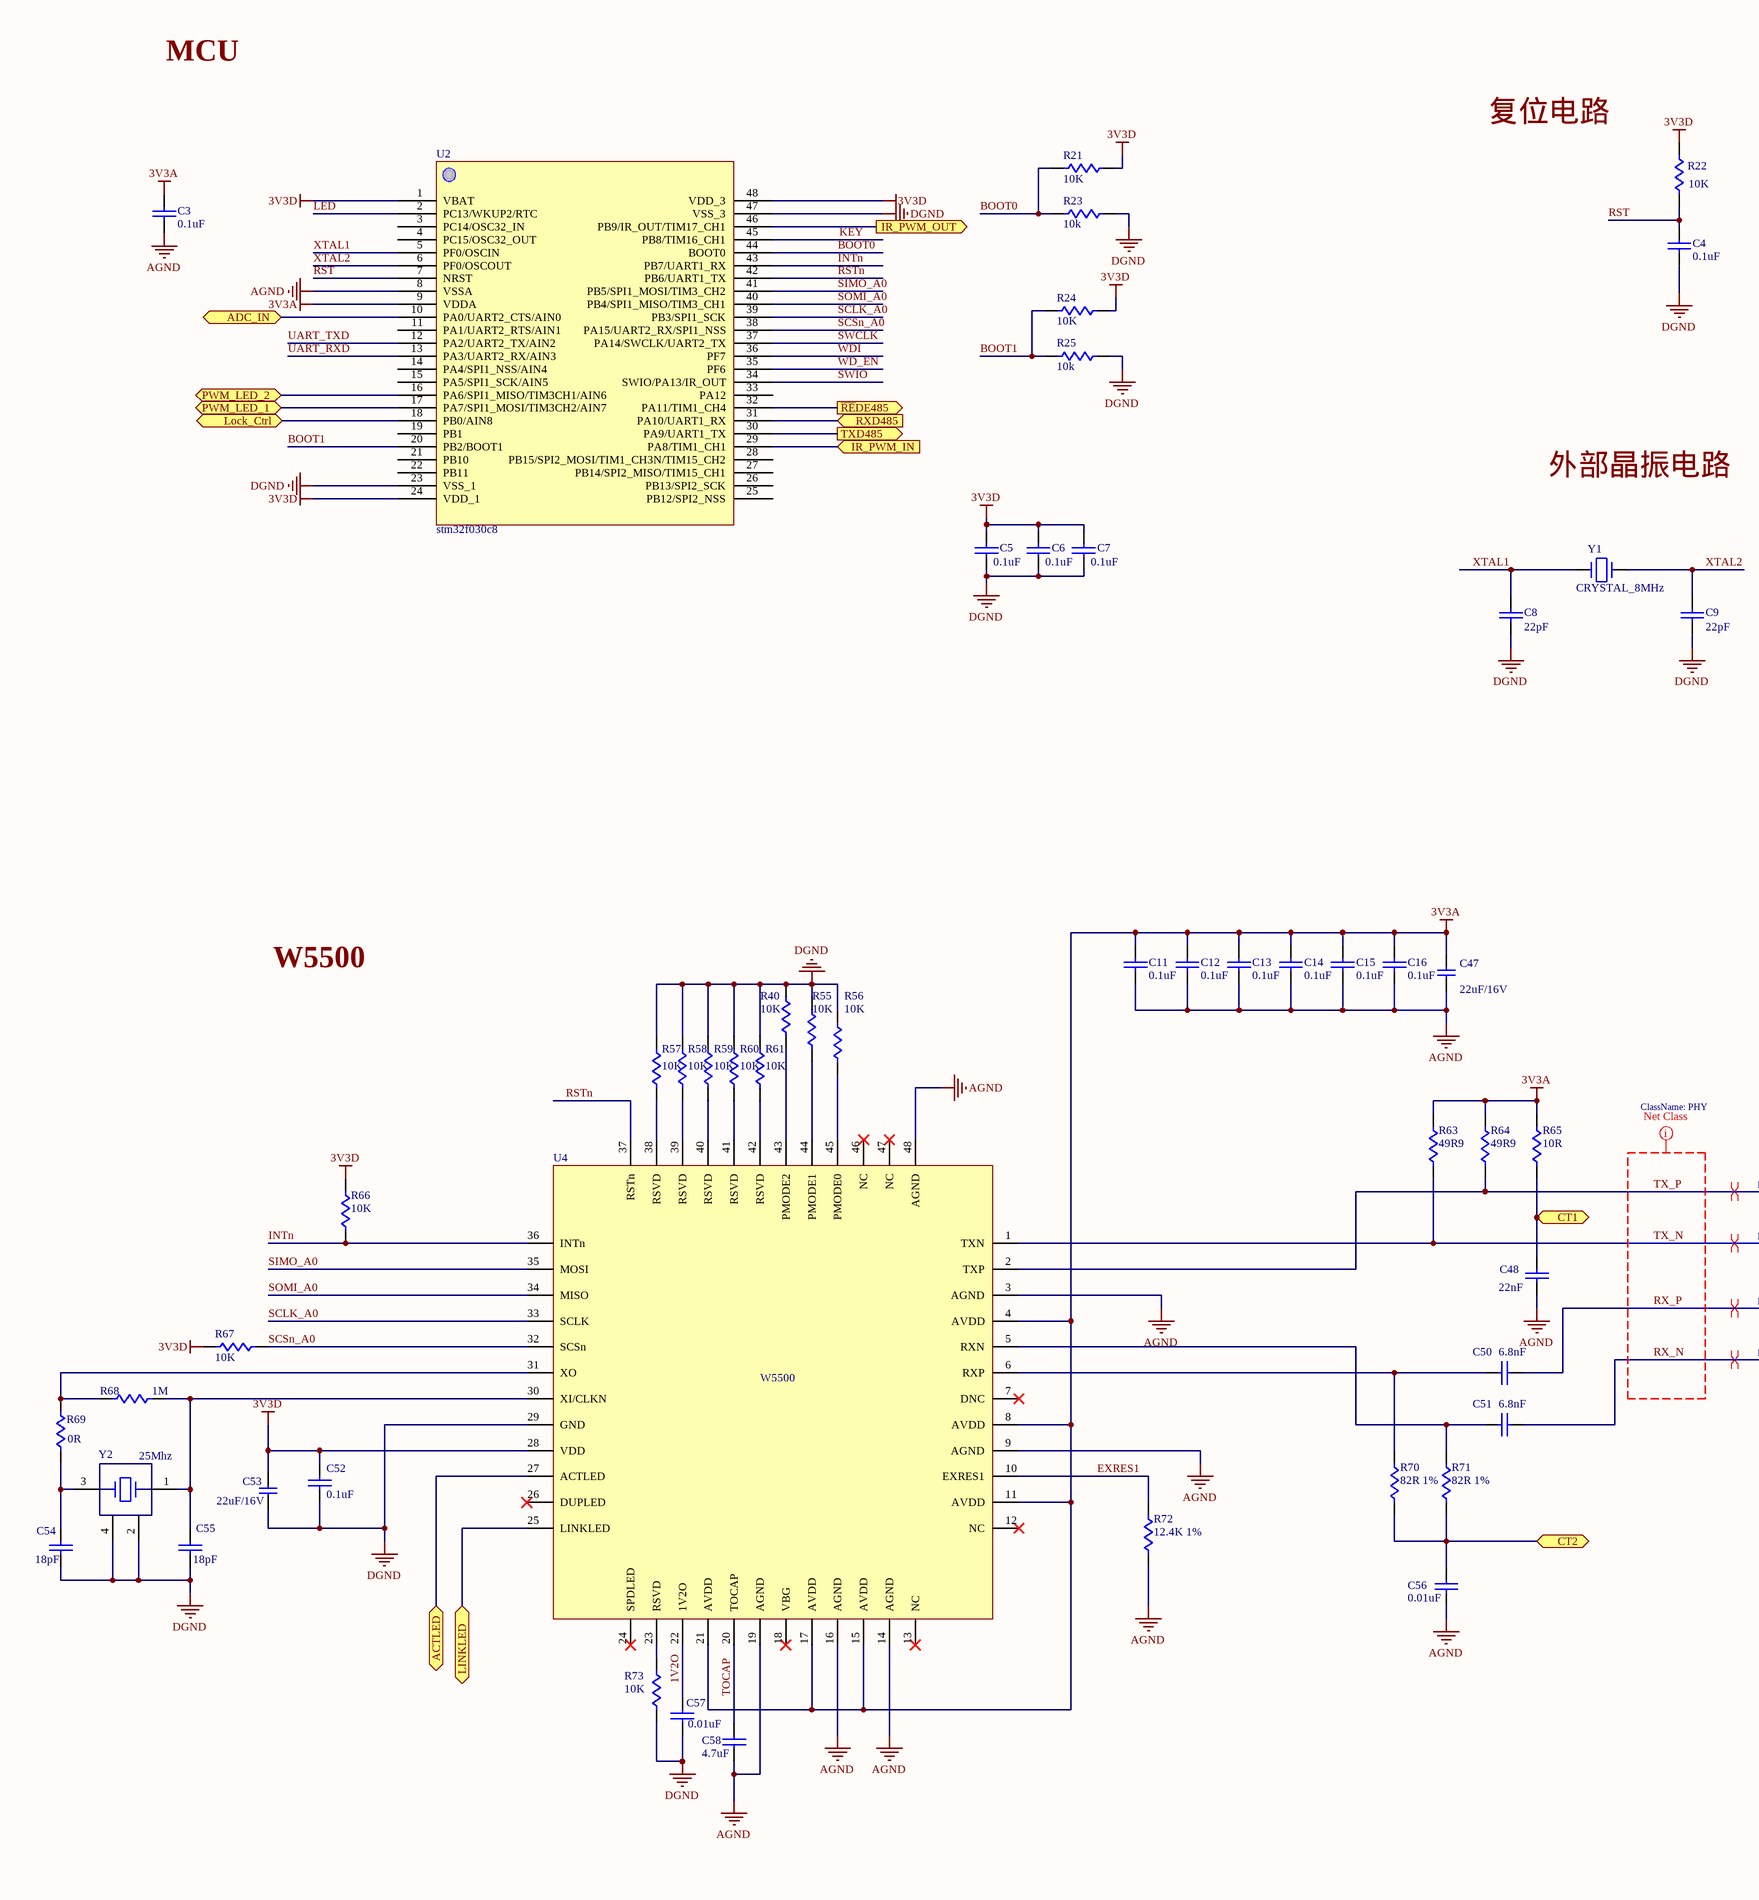
[diagram p2: bg_MCU.SchDoc, left]
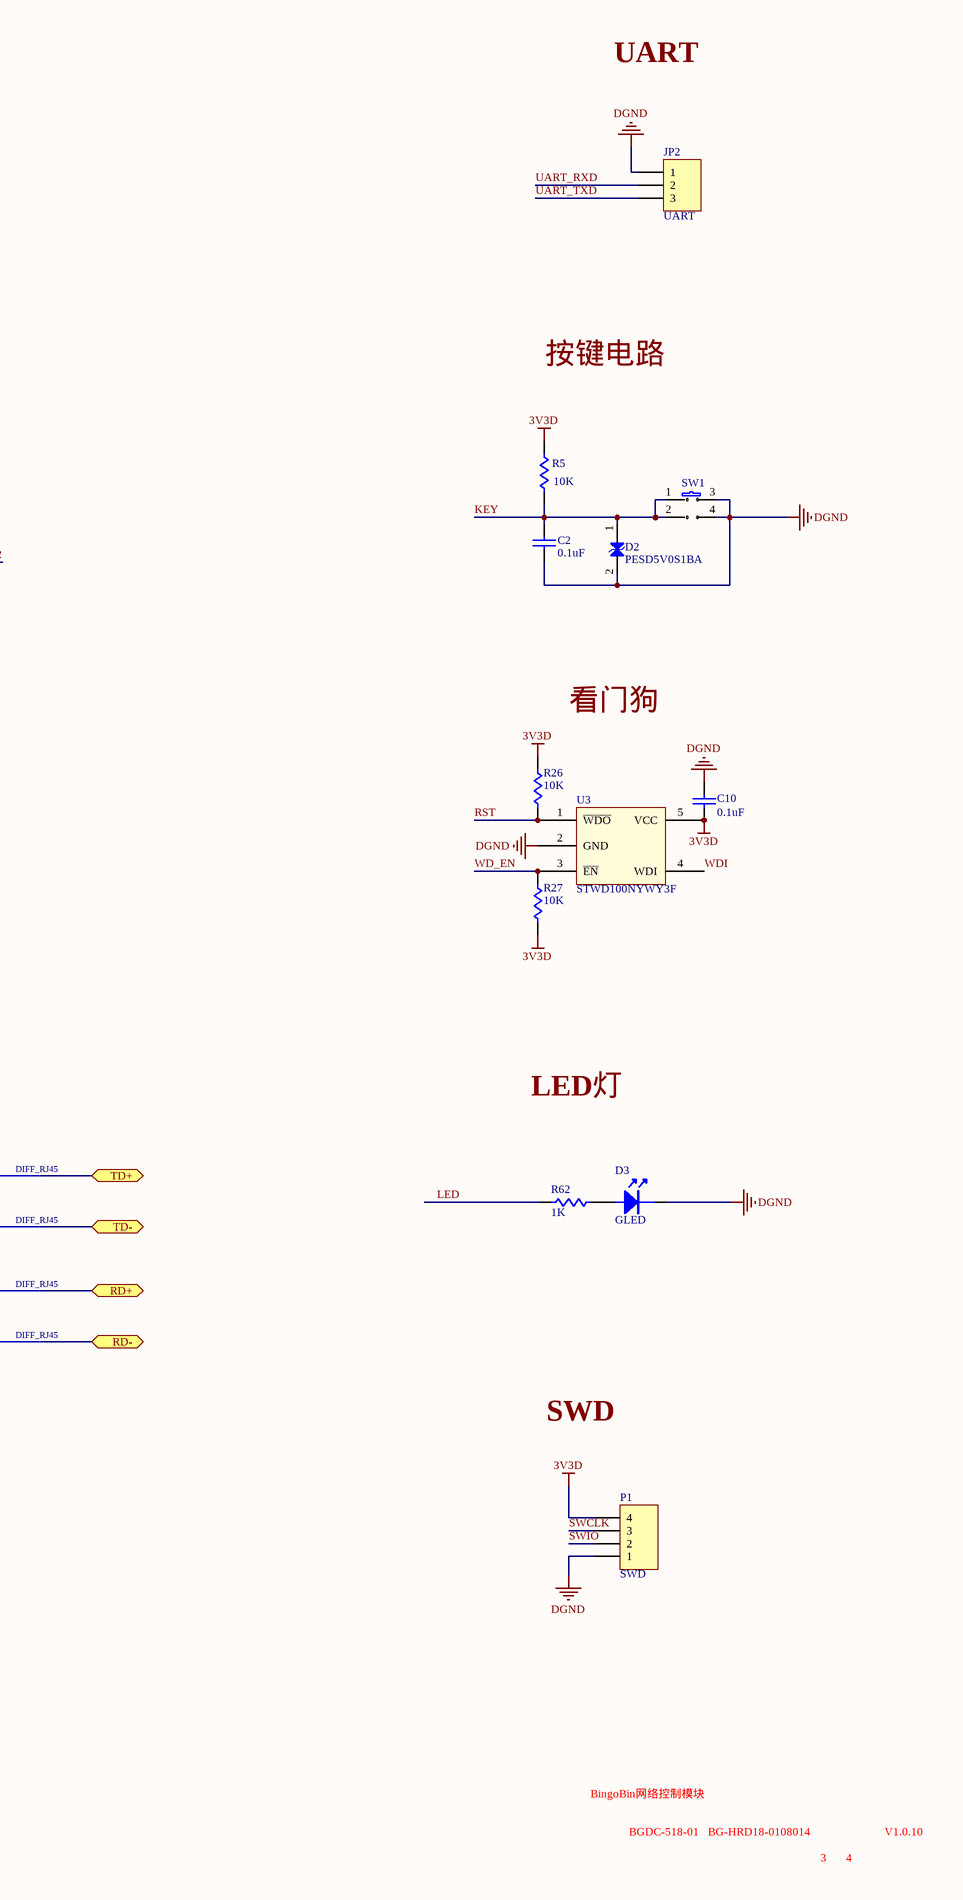
[diagram p3: bg_MCU.SchDoc, right]

### Parts
C2  0.1uF  [C0603]
C3  0.1uF  [C0603]
C4  0.1uF  [C0603]
C5  0.1uF  [C0603]
C6  0.1uF  [C0603]
C7  0.1uF  [C0603]
C8  22pF  [C0603]
C9  22pF  [C0603]
C10  0.1uF  [C0603]
C11  0.1uF  [C0603]
C12  0.1uF  [C0603]
C13  0.1uF  [C0603]
C14  0.1uF  [C0603]
C15  0.1uF  [C0603]
C16  0.1uF  [C0603]
C47  22uF/16V  [C1210]
C48  22nF  [C0603]
C50  6.8nF  [C0603]
C51  6.8nF  [C0603]
C52  0.1uF  [C0603]
C53  22uF/16V  [C1210]
C54  18pF  [C0603]
C55  18pF  [C0603]
C56  0.01uF  [C0603]
C57  0.01uF  [C0603]
C58  4.7uF  [C0603]
D2  PESD5V0S1BA  [SOD323]
D3  GLED  [LED-0805]
JP2  UART  [HDR1X3]
P1  SWD  [HDR1X4]
R5  10K  [R0603]
R21  10K  [R0603]
R22  10K  [R0603]
R23  10k  [R0603]
R24  10K  [R0603]
R25  10k  [R0603]
R26  10K  [R0603]
R27  10K  [R0603]
R40  10K  [R0603]
R55  10K  [R0603]
R56  10K  [R0603]
R57  10K  [R0603]
R58  10K  [R0603]
R59  10K  [R0603]
R60  10K  [R0603]
R61  10K  [R0603]
R62  1K  [R0603]
R63  49R9  [R0603]
R64  49R9  [R0603]
R65  10R  [R0603]
R66  10K  [R0603]
R67  10K  [R0603]
R68  1M  [R0603]
R69  0R  [R0603]
R70  82R 1%  [R0603]
R71  82R 1%  [R0603]
R72  12.4K 1%  [R0603]
R73  10K  [R0603]
SW1  K2-6639SP-I4SC-04  [KEY6*6mm]  (value not drawn)
U2  stm32f030c8  [LQFP48]
U3  STWD100NYWY3F  [SOT23-5]
U4  W5500  [W5500-LQFP-48_7x7x05P]
Y1  CRYSTAL_8MHz  [8M_SMD_CRYSTAL]
Y2  25Mhz  [25MHz-SMD-3225_4P]

### Ports
ACTLED (bidir), ADC_IN, CT1 (bidir), CT2 (bidir), IR_PWM_IN (in), IR_PWM_OUT (out), LINKLED (bidir), Lock_Ctrl, PWM_LED_1, PWM_LED_2, RD+ (bidir), RD- (bidir), RXD485 (in), TD+ (bidir), TD- (bidir), TXD485 (out), ~{RE}DE485 (out)

### Nets
3V3A: C3.1 C11.1 C12.1 C13.1 C14.1 C15.1 C16.1 C47.2 R63.2 R64.2 R65.2 U2.9(VDDA) U4.4(AVDD) U4.8(AVDD) U4.11(AVDD) U4.15(AVDD) U4.17(AVDD) U4.21(AVDD)
3V3D: C5.2 C6.2 C7.2 C10.2 C52.1 C53.2 P1.4 R5.2 R21.1 R22.2 R24.1 R26.2 R27.1 R66.2 R67.2 U2.1(VBAT) U2.24(VDD_1) U2.48(VDD_3) U3.5(VCC) U4.28(VDD)
AGND: C3.2 C11.2 C12.2 C13.2 C14.2 C15.2 C16.2 C47.1 C48.2 C56.2 C58.2 R72.1 U2.8(VSSA) U4.3(AGND) U4.9(AGND) U4.14(AGND) U4.16(AGND) U4.19(AGND) U4.48(AGND)
DGND: C2.1 C4.1 C5.1 C6.1 C7.1 C8.2 C9.2 C10.1 C52.2 C53.1 C54.2 C55.2 C57.2 D2.2 D3.2 JP2.1 P1.1 R23.1 R25.1 R40.2 R55.2 R56.2 R57.2 R58.2 R59.2 R60.2 R61.2 R73.1 SW1.3 SW1.4 U2.23(VSS_1) U2.47(VSS_3) U3.2(GND) U4.29(GND) Y2.2 Y2.4
1V2O: C57.1 U4.22(1V2O)
BOOT0: R21.2 R23.2 U2.44(BOOT0)
BOOT1: R24.2 R25.2 U2.20(PB2/BOOT1)
EXRES1: R72.2 U4.10(EXRES1)
INTn: R66.1 U2.43(PB7/UART1_RX) U4.36(INTn)
KEY: C2.2 D2.1 R5.1 SW1.1 SW1.2 U2.45(PB8/TIM16_CH1)
LED: R62.2 U2.2(PC13/WKUP2/RTC)
RST: C4.2 R22.1 R26.1 U2.7(NRST) U3.1(~{WDO})
RSTn: U2.42(PB6/UART1_TX) U4.37(RSTn)
RX_N: C51.2 ; port RD-
RX_P: C50.2 ; port RD+
SCLK_A0: U2.39(PB3/SPI1_SCK) U4.33(SCLK)
SCSn_A0: R67.1 U2.38(PA15/UART2_RX/SPI1_NSS) U4.32(SCSn)
SIMO_A0: U2.41(PB5/SPI1_MOSI/TIM3_CH2) U4.35(MOSI)
SOMI_A0: U2.40(PB4/SPI1_MISO/TIM3_CH1) U4.34(MISO)
SWCLK: P1.3 U2.37(PA14/SWCLK/UART2_TX)
SWIO: P1.2 U2.34(SWIO/PA13/IR_OUT)
TOCAP: C58.1 U4.20(TOCAP)
TX_N: R63.1 U4.1(TXN) ; port TD-
TX_P: R64.1 U4.2(TXP) ; port TD+
UART_RXD: JP2.2 U2.13(PA3/UART2_RX/AIN3)
UART_TXD: JP2.3 U2.12(PA2/UART2_TX/AIN2)
WD_EN: R27.2 U2.35(PF6) U3.3(~{EN})
WDI: U2.36(PF7) U3.4(WDI)
XTAL1: C8.1 U2.5(PF0/OSCIN) Y1.1
XTAL2: C9.1 U2.6(PF0/OSCOUT) Y1.2
NetC48_1: C48.1 R65.1 ; port CT1
NetC50_1: C50.1 R70.2 U4.6(RXP)
NetC51_1: C51.1 R71.2 U4.5(RXN)
NetC54_1: C54.1 R69.1 Y2.3
NetC55_1: C55.1 R68.1 U4.30(XI/CLKN) Y2.1
NetC56_1: C56.1 R70.1 R71.1 ; port CT2
NetD3_1: D3.1 R62.1
NetR2_1: U2.46(PB9/IR_OUT/TIM17_CH1) ; port IR_PWM_OUT
NetR3_1: U2.29(PA8/TIM1_CH1) ; port IR_PWM_IN
NetR28_2: U4.25(LINKLED) ; port LINKLED
NetR29_2: U4.27(ACTLED) ; port ACTLED
NetR40_1: R40.1 U4.43(PMODE2)
NetR55_1: R55.1 U4.44(PMODE1)
NetR56_1: R56.1 U4.45(PMODE0)
NetR57_1: R57.1 U4.38(RSVD)
NetR58_1: R58.1 U4.39(RSVD)
NetR59_1: R59.1 U4.40(RSVD)
NetR60_1: R60.1 U4.41(RSVD)
NetR61_1: R61.1 U4.42(RSVD)
NetR68_2: R68.2 R69.2 U4.31(XO)
NetR73_2: R73.2 U4.23(RSVD)
NetU2_10: U2.10(PA0/UART2_CTS/AIN0) ; port ADC_IN
NetU2_16: U2.16(PA6/SPI1_MISO/TIM3CH1/AIN6) ; port PWM_LED_2
NetU2_17: U2.17(PA7/SPI1_MOSI/TIM3CH2/AIN7) ; port PWM_LED_1
NetU2_18: U2.18(PB0/AIN8) ; port Lock_Ctrl
NetU2_30: U2.30(PA9/UART1_TX) ; port TXD485
NetU2_31: U2.31(PA10/UART1_RX) ; port RXD485
NetU2_32: U2.32(PA11/TIM1_CH4) ; port ~{RE}DE485

Not connected (* = marked no-connect by the designer): U2 3(PC14/OSC32_IN) 4(PC15/OSC32_OUT) 11(PA1/UART2_RTS/AIN1) 14(PA4/SPI1_NSS/AIN4) 15(PA5/SPI1_SCK/AIN5) 19(PB1) 21(PB10) 22(PB11) 25(PB12/SPI2_NSS) 26(PB13/SPI2_SCK) 27(PB14/SPI2_MISO/TIM15_CH1) 28(PB15/SPI2_MOSI/TIM1_CH3N/TIM15_CH2) 33(PA12); U4 7(DNC)* 12(NC)* 13(NC)* 18(VBG)* 24(SPDLED)* 26(DUPLED)* 46(NC)* 47(NC)*

### Layout directives
differential pair; net class DIFF_RJ45: RX_N, RX_P, TX_N, TX_P
net class PHY: RX_N, RX_P, TX_N, TX_P

### Notes on the sheet
- MCU
- UART
- 复位电路
- 按键电路
- 外部晶振电路
- 看门狗
- W5500
- LED灯
- SWD
- BingoBin网络控制模块
- BGDC-518-01   BG-HRD18-0108014
- 3
- 4
- V1.0.10

### Library data of the parts
C2-C7 C10-C16 C52 = C0603: Capacitor, Ceramic, 0.1uF, 16V, 10%, 0603, X7R; Value: 0.1uF
C8 C9 = C0603: Capacitor, Ceramic, 22pF, 50V, 5%, 0603, COG; Value: 22pF
C47 C53 = CAP_0603: Capacitor, Ceramic, 10uF,16V, 10%,1210,X5R; Part Number: C0603-4µ7; Note: 6.3V; Artikkelnr Noca: 20069060; Artikkelnr Simpro: N.A.; Manufacturer: *; Manufacturer Part Number: *; Datasheet: *; LatestRevisionDate: 2009-11-23; Pin Count: 2; Publisher: Nordic Semiconductor; Published: 2009-05-08; Value: 22uF/16V; Supplier: *; Supplier part number: *; 2nd source Supplier: *; 2nd source part number: *; Footprint Doc: 0603
C48 = C0603: Capacitor, Ceramic, 22nF, 25V, 10%, 0603, X7R; Value: 22nF
C50 C51 = C0603: Capacitor, Ceramic, 6.8nF, 50V, 10%, 0603, X7R; Value: 6.8nF
C54 C55 = C0603: Capacitor, Ceramic, 18pF, 50V, 5%, 0603, COG; Value: 18pF
C56 C57 = C0603: Capacitor, Ceramic, 0.01uF, 50V, 10%, 0603, X7R; Value: 0.01uF
C58 = C0603: Capacitor, Ceramic, 4.7uF, 16V, 10%, 0603, X7R; Value: 4.7uF
D2 = ESD: Manufacturer: NXP; Manufacturer Part Number: PESD5V0S1BA; Value: PESD5V0S1BA
D3 = LED_0805: 翠绿色 贴片LED ( Iv=220-270mcd @IF=5mA)
JP2 = Header 3: Header, 3-Pin, Single row; LatestRevisionDate: 17-Jul-2002; LatestRevisionNote: Re-released for DXP Platform.; Publisher: Altium Limited
P1 = Header 4: Header, 4-Pin; LatestRevisionDate: 17-Jul-2002; LatestRevisionNote: Re-released for DXP Platform.; Publisher: Altium Limited
R5 R21-R25 = R0603: RES, THICK FILM, 4.7K, 5%, 1/10W, 0603
  R5 R21 R22 R24: Value: 10K
  R23 R25: Value: 10k
R26 R27 R40 R55-R61 R66 R67 R73 = R0603: RES, THICK FILM, 10K, 5%, 1/10W, 0603; Value: 10K
R62 = R0603: RES, THICK FILM, 1K, 5%, 1/10W, 0603; Value: 1K
R63 R64 = R0603: RES, THICK FILM, 49.9 OHM, 1%, 1/10W, 0603; Value: 49R9
R65 = R0603: RES, THICK FILM, 10 OHM, 5%, 1/10W, 0603; Value: 10R
R68 = R0603: RES, THICK FILM, 1M, 5%, 1/10W, 0603; Value: 1M
R69 = R0603: RES, THICK FILM, 0 OHM, 1%, 1/10W, 0603; Value: 0R
R70 R71 = R0603: RES, THICK FILM, 82 OHM, 5%, 1/10W, 0603; Value: 82R 1%
R72 = R0603: RES, THICK FILM, 12.4K, 1%, 1/10W, 0603; Value: 12.4K 1%
SW1 = SW: Manufacturer: 韩国韩荣; Manufacturer Part Number: K2-6639SP-I4SC-04; Value: K2-6639SP-I4SC-04
U2 = stm32f030c8: mcu  LQFP-48_7x7x05P
U3 = STWD100: Watchdog timer circuit/1.6s; PCB DECAL: *; Source_Path: *; Value: *
U4 = W5500: TCP/IP嵌入式以太网控制器
Y1 = CRYSTAL_32.768k: 20PF 20PPM -40~+85℃ 编带
Y2 = 25Mhz: XTAL S3225 25M 12pF 10ppm 40R -20~70℃

## Sheet view.SchDoc
size A4
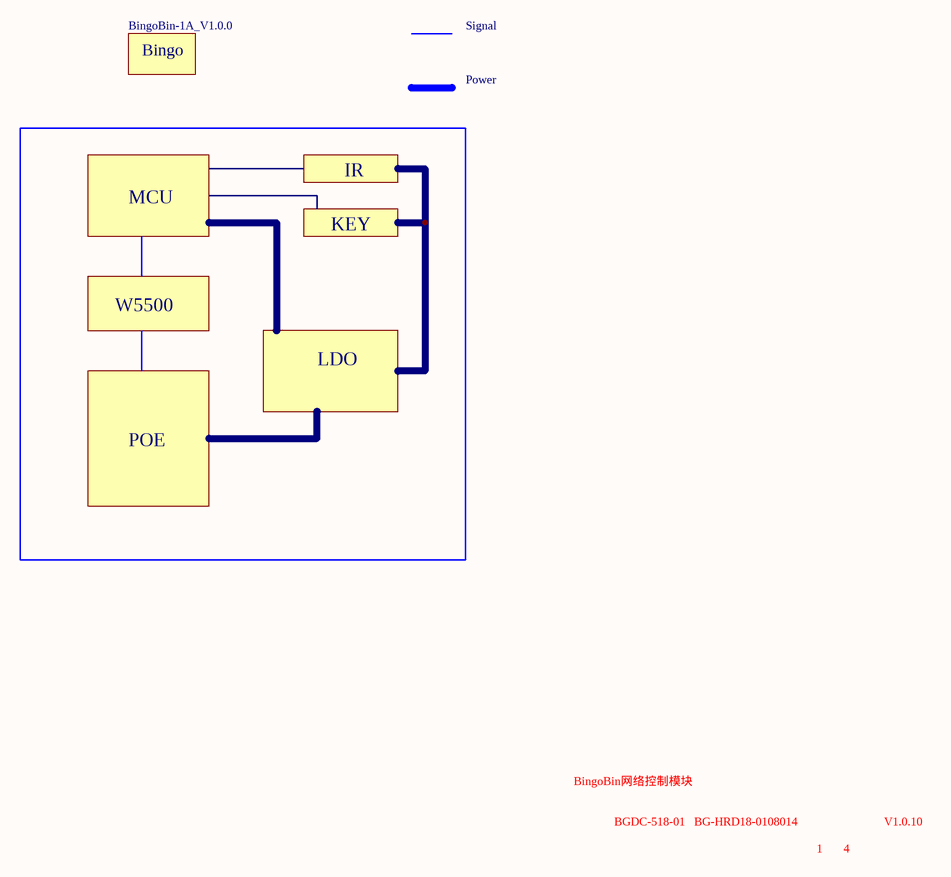
[diagram p4: view.SchDoc]

### Parts
BingoBin-1A_V1.0.0  BingoBin_V1.0.10  [bingo_logo]  (value not drawn)

### Notes on the sheet
- Signal
- Power
- IR
- MCU
- KEY
- W5500
- LDO
- POE
- BingoBin网络控制模块
- BGDC-518-01   BG-HRD18-0108014
- 1
- 4
- V1.0.10
- (in symbol bingo_logo) Bingo

### Library data of the parts
BingoBin-1A_V1.0.0 = bingo_logo: bingo logo; value: BingoBin_V1.0.10

## Nets that join several sheets
3V3A: bg_power (3V3A.1 L4.2), bg_MCU (18 pins)
3V3D: bg_power (5 pins), bg_sensor (C1.2 R1.2 R3.2 U1.3), bg_MCU (20 pins)
AGND: bg_power (AGND.1 L3.2), bg_MCU (19 pins)
DGND: bg_power (25 pins), bg_sensor (C1.1 Q1.2 R4.1 U1.2), bg_MCU (36 pins)
NetC48_1: bg_power (T1.2), bg_MCU (C48.1 R65.1)
NetC56_1: bg_power (T1.7), bg_MCU (C56.1 R70.1 R71.1)
NetR2_1: bg_sensor (R2.1), bg_MCU (U2.46)
NetR3_1: bg_sensor (R3.1 U1.1), bg_MCU (U2.29)
NetR28_2: bg_power (R28.2), bg_MCU (U4.25)
NetR29_2: bg_power (R29.2), bg_MCU (U4.27)
RX_N: bg_power (T1.8), bg_MCU (C51.2)
RX_P: bg_power (T1.6), bg_MCU (C50.2)
TX_N: bg_power (T1.3), bg_MCU (R63.1 U4.1)
TX_P: bg_power (T1.1), bg_MCU (R64.1 U4.2)